# Altium schematic sheet Solder Training Tier 2.SchDoc
size A; SheetNumber: 1; SheetTotal: 1
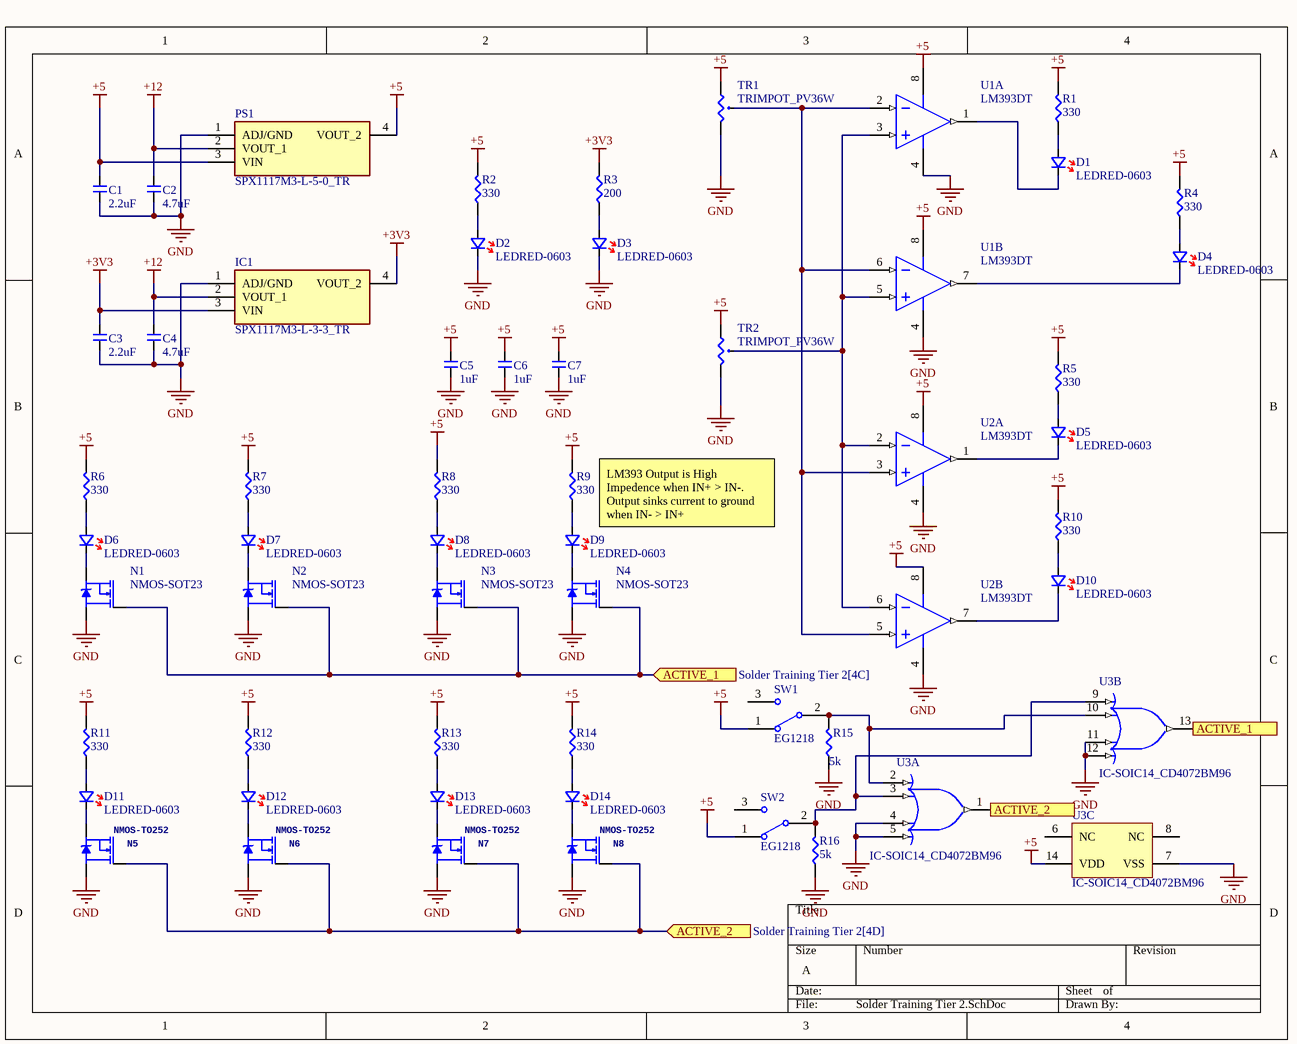
[diagram p0: Solder Training Tier 2.SchDoc]

## Parts
C1  2.2uF  [CAP-0603]
C2  4.7uF  [CAP-0603]
C3  2.2uF  [CAP-0603]
C4  4.7uF  [CAP-0603]
C5  1uF  [CAP-0603]
C6  1uF  [CAP-0603]
C7  1uF  [CAP-0603]
D1  LEDRED-0603  [LEDRED-0603]
D2  LEDRED-0603  [LEDRED-0603]
D3  LEDRED-0603  [LEDRED-0603]
D4  LEDRED-0603  [LEDRED-0603]
D5  LEDRED-0603  [LEDRED-0603]
D6  LEDRED-0603  [LEDRED-0603]
D7  LEDRED-0603  [LEDRED-0603]
D8  LEDRED-0603  [LEDRED-0603]
D9  LEDRED-0603  [LEDRED-0603]
D10  LEDRED-0603  [LEDRED-0603]
D11  LEDRED-0603  [LEDRED-0603]
D12  LEDRED-0603  [LEDRED-0603]
D13  LEDRED-0603  [LEDRED-0603]
D14  LEDRED-0603  [LEDRED-0603]
IC1  SPX1117M3-L-3-3_TR  [SOT230P700X180-4N]
N1  NMOS-SOT23  [SOT23]
N2  NMOS-SOT23  [SOT23]
N3  NMOS-SOT23  [SOT23]
N4  NMOS-SOT23  [SOT23]
N5  NMOS-TO252  [TO252]
N6  NMOS-TO252  [TO252]
N7  NMOS-TO252  [TO252]
N8  NMOS-TO252  [TO252]
PS1  SPX1117M3-L-5-0_TR  [SOT230P700X170-4N]
R1  330  [RES-0603]
R2  330  [RES-0603]
R3  200  [RES-0603]
R4  330  [RES-0603]
R5  330  [RES-0603]
R6  330  [RES-0603]
R7  330  [RES-0603]
R8  330  [RES-0603]
R9  330  [RES-0603]
R10  330  [RES-0603]
R11  330  [RES-0603]
R12  330  [RES-0603]
R13  330  [RES-0603]
R14  330  [RES-0603]
R15  5k  [RES-0603]
R16  5k  [RES-0603]
SW1  EG1218  [ESWI-EG1218_V]
SW2  EG1218  [ESWI-EG1218_V]
TR1  TRIMPOT_PV36W  [TRIMPOT_PV36W]
TR2  TRIMPOT_PV36W  [TRIMPOT_PV36W]
U1  LM393DT  [STM-SO-8_D_L]  (parts A,B of 2)
U2  LM393DT  [STM-SO-8_D_L]  (parts A,B of 2)
U3  IC-SOIC14_CD4072BM96  [SOIC127P600X175-14N]  (parts A,B,C of 3)

## Ports
ACTIVE_1 (in, see Solder Training Tier 2[3C]), ACTIVE_1 (in, see Solder Training Tier 2[4C]), ACTIVE_2 (in, see Solder Training Tier 2[4D]), ACTIVE_2 (see Solder Training Tier 2[3D])

## Nets
+3V3: C3.2 IC1.3(VIN) IC1.4(VOUT_2) R3.2
+5: C1.2 C5.2 C6.2 C7.2 PS1.3(VIN) PS1.4(VOUT_2) R1.2 R2.2 R4.2 R5.2 R6.2 R7.2 R8.2 R9.2 R10.2 R11.2 R12.2 R13.2 R14.2 SW1.1 SW2.1 TR1.1 TR2.1 U1.8(VCC+) U2.8(VCC+) U3.14(VDD)
+12: C2.2 C4.2 IC1.2(VOUT_1) PS1.2(VOUT_1)
GND: C1.1 C2.1 C3.1 C4.1 C5.1 C6.1 C7.1 D2.K D3.K IC1.1(ADJ/GND) N1.2(S) N2.2(S) N3.2(S) N4.2(S) N5.2(S) N6.2(S) N7.2(S) N8.2(S) PS1.1(ADJ/GND) R15.1 R16.1 TR1.3 TR2.3 U1.4(VCC-) U2.4(VCC-) U3.4(C) U3.5(D) U3.7(VSS) U3.11(G) U3.12(H)
ACTIVE_1: N1.1(G) N2.1(G) N3.1(G) N4.1(G) U3.13(K) ; port ACTIVE_1
ACTIVE_2: N5.1(G) N6.1(G) N7.1(G) N8.1(G) U3.1(J) ; port ACTIVE_2
NetD1_A: D1.A R1.1
NetD1_K: D1.K U1.1(OUT1)
NetD2_A: D2.A R2.1
NetD3_A: D3.A R3.1
NetD4_A: D4.A R4.1
NetD4_K: D4.K U1.7(OUT2)
NetD5_A: D5.A R5.1
NetD5_K: D5.K U2.1(OUT1)
NetD6_A: D6.A R6.1
NetD6_K: D6.K N1.3(D)
NetD7_A: D7.A R7.1
NetD7_K: D7.K N2.3(D)
NetD8_A: D8.A R8.1
NetD8_K: D8.K N3.3(D)
NetD9_A: D9.A R9.1
NetD9_K: D9.K N4.3(D)
NetD10_A: D10.A R10.1
NetD10_K: D10.K U2.7(OUT2)
NetD11_A: D11.A R11.1
NetD11_K: D11.K N5.3(D)
NetD12_A: D12.A R12.1
NetD12_K: D12.K N6.3(D)
NetD13_A: D13.A R13.1
NetD13_K: D13.K N7.3(D)
NetD14_A: D14.A R14.1
NetD14_K: D14.K N8.3(D)
NetR15_2: R15.2 SW1.2(COM) U3.2(A) U3.10(F)
NetR16_2: R16.2 SW2.2(COM) U3.3(B) U3.9(E)
NetTR1_2: TR1.2 U1.2(IN1-) U1.6(IN2-) U2.3(IN1+) U2.5(IN2+)
NetTR2_2: TR2.2 U1.3(IN1+) U1.5(IN2+) U2.2(IN1-) U2.6(IN2-)

Not connected (* = marked no-connect by the designer): SW1 3; SW2 3; U3 6(NC) 8(NC)

## Notes on the sheet
- LM393 Output is High Impedence when IN+ > IN-.  Output sinks current to ground when IN- > IN+

## Library data of the parts
C1-C7 = CMP-009-000303-1: Source: ife19_Elec_Library.SchLib; Design Item ID: CAP-0603
D1-D14 = CMP-009-000189-1: Design Item ID: LEDRED-0603; Source: ife19_Elec_Library.SchLib
IC1 = CMP-040-000003-1: Integrated Circuit; Manufacturer_Part_Number: SPX1117M3-L-3-3/TR; Manufacturer_Name: EXAR; Arrow Part Number: SPX1117M3-L-3-3/TR; Design Item ID: SPX1117M3-L-3-3_TR; Mouser Part Number: 701-SPX1117M3-L-33TR; Source: SamacSys.SchLib; Height: 1.8mm; Mouser Price/Stock: https://www.mouser.com/Search/Refine.aspx?Keyword=701-SPX1117M3-L-33TR; Datasheet Link: https://componentsearchengine.com/Datasheets/2/SPX1117M3-L-3-3_TR.pdf; Arrow Price/Stock: https://www.arrow.com/en/products/spx1117m3-l-3-3tr/exar
N1-N4 = CMP-009-000184-1: Design Item ID: NMOS-SOT23; Source: ife19_Elec_Library.SchLib
N5-N8 = CMP-011-000011-1: SymbolName_1: LABELED-PMOS; DeviceSetName: DMP10H400SK3-13; GateName_1: G$1; Source: ife19_Elec_Library.SchLib; LibraryName: IFE_Transistors; Design Item ID: NMOS-TO252; Package: TO252
PS1 = CMP-042-000000-1: Power Supply; Manufacturer_Name: EXAR; Manufacturer_Part_Number: SPX1117M3-L-5-0/TR; Arrow Part Number: SPX1117M3-L-5-0/TR; Arrow Price/Stock: https://www.arrow.com/en/products/spx1117m3-l-5-0tr/exar; Mouser Price/Stock: https://www.mouser.com/Search/Refine.aspx?Keyword=701-SPX1117M3-L-50TR; Height: 1.7mm; Design Item ID: SPX1117M3-L-5-0_TR; Datasheet Link: https://datasheet.datasheetarchive.com/originals/distributors/Datasheets-DGA25/1769206.pdf; Mouser Part Number: 701-SPX1117M3-L-50TR; Source: SamacSys.SchLib
R1-R16 = CMP-014-000032-1: Source: ife19_Elec_Library.SchLib; Design Item ID: RES-0603
SW1 SW2 = CMP-1696-00002-1: Slide Switch, 500 V, -20 to 70 degC, 3-Pin THD, RoHS; Case\Package: SOT-23-5; Output Current: 150 mA; Nominal Output Voltage: 3.3 V; Max Power Dissipation: 250 mW; Min Input Voltage: 4.3 V; Outputs: 1; Max Input Voltage: 8 V; Dropout Voltage: 300 mV; PackageDescription: 3-Pin Through Hole Device, Body 11.6 x 4 mm, Pitch 2.5 mm; ComponentLink1URL: http://www.e-switch.ch/en/; RoHSCompliant: true; Length: 3 mm; ComponentLink1Description: Manufacturer URL; Power Rating: 250 mW; Mount: Surface Mount; Max Operating Temperature: 85 degC; REACH SVHC: No SVHC; Radiation Hardening: No; Height: 1.3 mm; Pins: 5; Max Ouput Current: 150 mA; Output Voltage: 3.3 V; Width: 1.8 mm; Package Quantity: 3000; ComponentLink2URL: https://www.e-switch.com/system/asset/product_line/data_sheet/119/EG.pdf; Min Operating Temperature: -40 degC; ComponentLink2Description: Datasheet; DatasheetVersion: Oct-15; PackageReference: EG1218; Packaging: Tape and Reel
TR1 TR2 = CMP-009-000197-1: Source: ife19_Elec_Library.SchLib; Design Item ID: TRIMPOT_PV36W
U1 U2 = CMP-2000-06550-1: Low-Power, Dual-Voltage Comparator, 2 to 36 V, 0 to 70 degC, 8-Pin SOIC (SO), RoHS, Tape and Reel; Manufacturer: STMicroelectronics; Voltage - Supply, Single/Dual (±): 2V~36V,±1V~18V; Current - Input Bias (Max): 0.25µA@5V; Number of Elements: 2; Current - Output (Typ): 18mA@5V; Other Names: 497-1593-2; Voltage - Input Offset (Max): 5mV@30V; Output Type: CMOS,DTL,ECL,MOS,Open-Collector,TTL; EDA / CAD Models: DownloadfromAcceleratedDesigns; Other Related Documents: LM393ViewAllSpecificationsLM393ViewAllSpecifications; Online Catalog: Comparators-2elements; Current - Quiescent (Max): 2.5mA; Standard Package: 2,500; Manufacturer URL: http://www.st.com/; Package Description: 8-Pin Small Outline Integrated Circuit, Body 4.9 x 3.9 mm, Pitch 1.27 mm; Packaging: Tape&Reel(TR); Datasheet Version: Rev. 15, 02/2016; Category: IntegratedCircuits(ICs); Operating Temperature: 0°C~70°C; Mounting Type: SurfaceMount; Supplier Device Package: 8-SO; Datasheet URL: http://www.st.com/content/ccc/resource/technical/document/datasheet/group1/b4/cc/cf/13/18/28/44/f5/CD00000465/files/CD00000465.pdf/jcr:content/translations/en.CD00000465.pdf; Family: Linear-Comparators; Mounting Technology: SurfaceMount; Type: GeneralPurpose; Package Reference: SO-8; Package / Case: 8-SOIC(0.154",3.90mmWidth)
U3 = CMP-013-000040-1: Logic Gates CMOS Dual 4-Input OR; Manufacturer: Texas Instruments; Number of Input Lines: 4; Number of Bits: 2; High Level Output Current: 3.4mA; Max Supply Voltage: 18V; Number of Output Lines: 1; Output Current: 6.8mA; Min Supply Voltage: 3V; Turn-On Delay Time: 120ns; Propagation Delay: 90ns; Quiescent Current: 5uA; Mount: Surface Mount; RoHS: Yes; Lead Free: Lead Free; Number of Elements: 2; Manufacturer Part Number: CD4072BM96; Packaging: Tape and Reel; Number of Gates: 2; ComponentLink3Description: http://www.produktinfo.conrad.com/datenblaetter/1000000-1099999/001073543-da-01-en-IC_DUAL_4INPUT_OR_CD4072BM96_SOIC_14_TID.pdf?src-supplier=Conrad; Contact Plating: Gold; Source: ife19_Elec_Library.SchLib; Case/Package: SOIC; Max Operating Temperature: 125°C; ComponentLink1URL: http://www.ti.com/general/docs/lit/getliterature.tsp?genericPartNumber=CD4072B-MIL&&fileType=pdf&src-supplier=Avnet; Package Quantity: 1; Number of Inputs: 4; ComponentLink2URL: http://www.farnell.com/datasheets/1834701.pdf?src-supplier=Element14; Stock 1: 5874; Number of Pins: 14; Logic Function: OR; ComponentLink1Description: http://www.ti.com/general/docs/lit/getliterature.tsp?genericPartNumber=CD4072B-MIL&&fileType=pdf&src-supplier=Avnet; Pricing 1: 1 = 0.42000, 10 = 0.35900, 100 = 0.26820, 500 = 0.21074, 1000 = 0.16284 (USD); Design Item ID: IC-SOIC14_CD4072BM96; ComponentLink2Description: http://www.farnell.com/datasheets/1834701.pdf?src-supplier=Element14; Number of Outputs: 1; REACH SVHC: No SVHC; Number of Circuits: 2; Low Level Output Current: 3.4mA; Min Operating Temperature: -55°C; Weight: 0.004564oz; ComponentLink3URL: http://www.produktinfo.conrad.com/datenblaetter/1000000-1099999/001073543-da-01-en-IC_DUAL_4INPUT_OR_CD4072BM96_SOIC_14_TID.pdf?src-supplier=Conrad